# Altium schematic sheet dod2.SchDoc
size A4
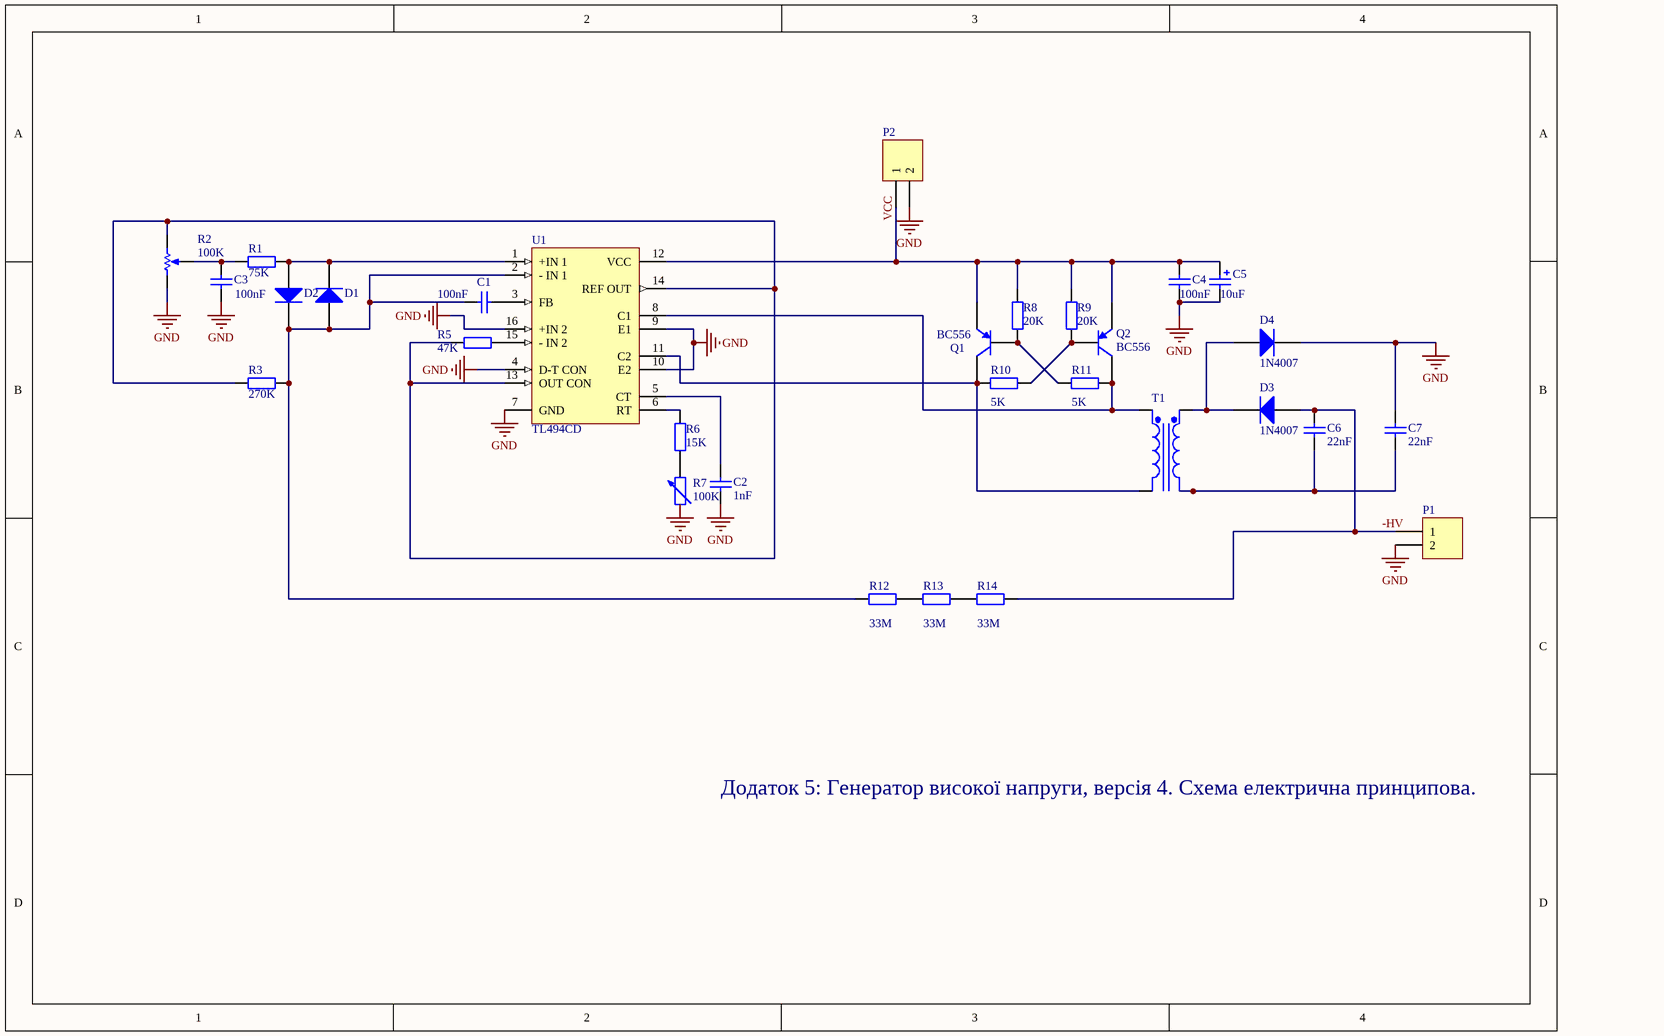
[diagram p0: dod2.SchDoc]

## Parts
C1  value 100nF  [RAD-0.3]  (hidden comment: Cap)
C2  value 1nF  [RAD-0.3]  (hidden comment: Cap)
C3  value 100nF  [RAD-0.3]  (hidden comment: Cap)
C4  value 100nF  [RAD-0.3]  (hidden comment: Cap)
C5  value 10uF  [POLAR0.8]  (hidden comment: Cap Pol2)
C6  value 22nF  [RAD-0.3]  (hidden comment: Cap)
C7  value 22nF  [RAD-0.3]  (hidden comment: Cap)
D1  Diode 1N914  [DO-35]  (value not drawn)
D2  Diode 1N914  [DO-35]  (value not drawn)
D3  1N4007  [DO-41]
D4  1N4007  [DO-41]
P1  Header 2  [HDR1X2]  (value not drawn)
P2  Header 2  [HDR1X2]  (value not drawn)
Q1  BC556  [TO-92A]
Q2  BC556  [TO-92A]
R1  value 75K  [AXIAL-0.4]  (hidden comment: Res2)
R2  value 100K  [VR5]  (hidden comment: RPot)
R3  value 270K  [AXIAL-0.4]  (hidden comment: Res2)
R5  value 47K  [AXIAL-0.4]  (hidden comment: Res2)
R6  value 15K  [AXIAL-0.4]  (hidden comment: Res2)
R7  value 100K  [AXIAL-0.6]  (hidden comment: Res Adj2)
R8  value 20K  [AXIAL-0.4]  (hidden comment: Res2)
R9  value 20K  [AXIAL-0.4]  (hidden comment: Res2)
R10  value 5K  [AXIAL-0.4]  (hidden comment: Res2)
R11  value 5K  [AXIAL-0.4]  (hidden comment: Res2)
R12  value 33M  [AXIAL-0.4]  (hidden comment: Res2)
R13  value 33M  [AXIAL-0.4]  (hidden comment: Res2)
R14  value 33M  [AXIAL-0.4]  (hidden comment: Res2)
T1  Trans Cupl  [TRF_4]  (value not drawn)
U1  TL494CD  [D016_N]

## Nets
GND: C2.2 C3.1 C4.2 C5.2 C7.2 D4.2(K) P1.2 P2.2 R2.1(TOP) U1.4(D-T_CON) U1.7(GND) U1.9(E1) U1.10(E2) U1.16(+IN_2)
-HV: C6.2 D3.1(A) P1.1 R14.2
VCC: C4.1 C5.1 P2.1 Q1.1(E) Q2.1(E) R8.2 R9.2 U1.12(VCC)
NetC1_1: C1.1 D1.1(A) D2.2(K) R3.2 R12.1 U1.2(-_IN_1)
NetC1_2: C1.2 U1.3(FB)
NetC2_1: C2.1 U1.5(CT)
NetC3_2: C3.2 R1.1 R2.3(TAP)
NetC6_1: C6.1 C7.1 T1.4(Sec-)
NetD1_2: D1.2(K) D2.1(A) R1.2 U1.1(+IN_1)
NetD3_2: D3.2(K) D4.1(A) T1.3(Sec+)
NetQ1_2: Q1.2(B) R8.1 R11.1
NetQ1_3: Q1.3(C) R10.1 T1.2(Pri-) U1.11(C2)
NetQ2_2: Q2.2(B) R9.1 R10.2
NetQ2_3: Q2.3(C) R11.2 T1.1(Pri+) U1.8(C1)
NetR2_2: R2.2(BOT) R3.1 R5.1 U1.13(OUT_CON) U1.14(REF_OUT)
NetR5_2: R5.2 U1.15(-_IN_2)
NetR6_1: R6.1 R7.2
NetR6_2: R6.2 U1.6(RT)
NetR12_2: R12.2 R13.1
NetR13_2: R13.2 R14.1

Not connected (* = marked no-connect by the designer): R7 1

## Notes on the sheet
- Додаток 5: Генератор високої напруги, версія 4. Схема електрична принципова.
- Labels drawn without touching a wire or pin: GND

## Library data of the parts
C1-C4 C6 C7 = Cap: Capacitor; Published: 8-Jun-2000; LatestRevisionDate: 17-Jul-2002; LatestRevisionNote: Re-released for DXP Platform.; PackageReference: RAD-0.3; Publisher: Altium Limited; PackageDescription: Radial Cap, Thru-Hole; 2 Leads; 0.3 in Pin Spacing
C5 = Cap Pol2: Polarized Capacitor (Axial); Published: 8-Jun-2000; LatestRevisionDate: 17-Jul-2002; LatestRevisionNote: Re-released for DXP Platform.; PackageReference: POLAR0.8; Publisher: Altium Limited; PackageDescription: Polarized Capacitor; 2 Leads
D1 D2 = Diode 1N914: High Conductance Fast Diode; Published: 8-Jun-2000; LatestRevisionDate: 17-Jul-2002; LatestRevisionNote: Re-released for DXP Platform.; DatasheetVersion: 1997; PackageReference: DO-35; Publisher: Altium Limited; PackageDescription: Diode, Axial; Body 3.8 x 1.9 mm (LxDia. max), Lead Dia. 0.53 mm (max); Code_JEDEC: DO-204-AH; ComponentLink1Description: Manufacturer Link; ComponentLink1URL: http://www.fairchildsemi.com/; ComponentLink2Description: Datasheet; ComponentLink2URL: http://www.fairchildsemi.com/ds/1N%2F1N4448.pdf
D3 D4 = Diode 1N4007: 1 Amp General Purpose Rectifier; Published: 8-Jun-2000; LatestRevisionDate: 17-Jul-2002; LatestRevisionNote: Re-released for DXP Platform.; DatasheetVersion: 1998; PackageVersion: Aug-1999; PackageReference: DO-41; Publisher: Altium Limited; PackageDescription: Diode, Axial; Body 5.2 x 2.7 mm (LxDia. max), Lead Dia. 0.86 mm (max); Code_JEDEC: DO-204-AL; ComponentLink1Description: Manufacturer Link; ComponentLink1URL: http://www.fairchildsemi.com/; ComponentLink2Description: Datasheet; ComponentLink2URL: http://www.fairchildsemi.com/ds/1N%2F1N4001.pdf
P1 P2 = Header 2: Header, 2-Pin; LatestRevisionDate: 17-Jul-2002; LatestRevisionNote: Re-released for DXP Platform.; Publisher: Altium Limited
Q1 Q2 = 2N3906: PNP General Purpose Amplifier; Published: 8-Jun-2000; LatestRevisionDate: 15-Jan-2003; LatestRevisionNote: PCB Footprint 'BCY-W3/D4.7' replaced; DatasheetVersion: 1997; PackageVersion: Sep-1998; PackageReference: TO-92A; Publisher: Altium Limited; PackageDescription: TO, Flat Index; 3 In-Line, Axial Leads; Body Dia. 4.5mm; Leads 0.51 x 0.48 mm (max); ComponentLink1Description: Manufacturer Link; ComponentLink1URL: http://www.fairchildsemi.com/; ComponentLink2Description: Datasheet; ComponentLink2URL: http://www.fairchildsemi.com/ds/2N%2F2N3906.pdf
R1 R3 R5 R6 R8-R14 = Res2: Resistor; Published: 8-Jun-2000; LatestRevisionDate: 17-Jul-2002; LatestRevisionNote: Re-released for DXP Platform.; PackageReference: AXIAL-0.4; Publisher: Altium Limited; PackageDescription: Axial Device, Thru-Hole; 2 Leads; 0.4 in Pin Spacing
R2 = RPot: Potentiometer; Sim Note: Enter the Resistance value and the set point into parameter fields.; Set Position: 0.5; Published: 8-Jun-2000; LatestRevisionDate: 17-Jul-2002; LatestRevisionNote: Re-released for DXP Platform.; PackageReference: VR5; Publisher: Altium Limited; PackageDescription: Variable Resistor, Thru-Hole; 3 Leads
R7 = Res Adj2: Variable Resistor; Set Position: 0.5; Published: 8-Jun-2000; LatestRevisionDate: 17-Jul-2002; LatestRevisionNote: Re-released for DXP Platform.; PackageReference: AXIAL-0.6; Publisher: Altium Limited; PackageDescription: Axial Device, Thru-Hole; 2 Leads; 0.6 in Pin Spacing
T1 = Trans Cupl: Transformer (Coupled Inductor Model); Published: 8-Jun-2000; LatestRevisionDate: 17-Jul-2002; LatestRevisionNote: Re-released for DXP Platform.; PackageReference: TRF_4; Publisher: Altium Limited; PackageDescription: Transformer; 4 Leads
U1 = TL494CD: Pulse-Width-Modulation Control Circuit; Published: 15-Apr-2002; LatestRevisionDate: 13-Apr-2006; LatestRevisionNote: IPC-7351 Footprint Added.; DatasheetVersion: Oct-1988; PackageVersion: Jan-1998; PackageReference: D016; Publisher: Altium Limited; PackageDescription: 16-Pin Small Outline Integrated Circuit 1.27 mm Pitch; Code_IPC: SOIC127P600-16; ComponentLink1Description: Manufacturer Link; ComponentLink1URL: http://www.ti.com/